# Altium schematic sheet ST-LINK.SchDoc
size A4
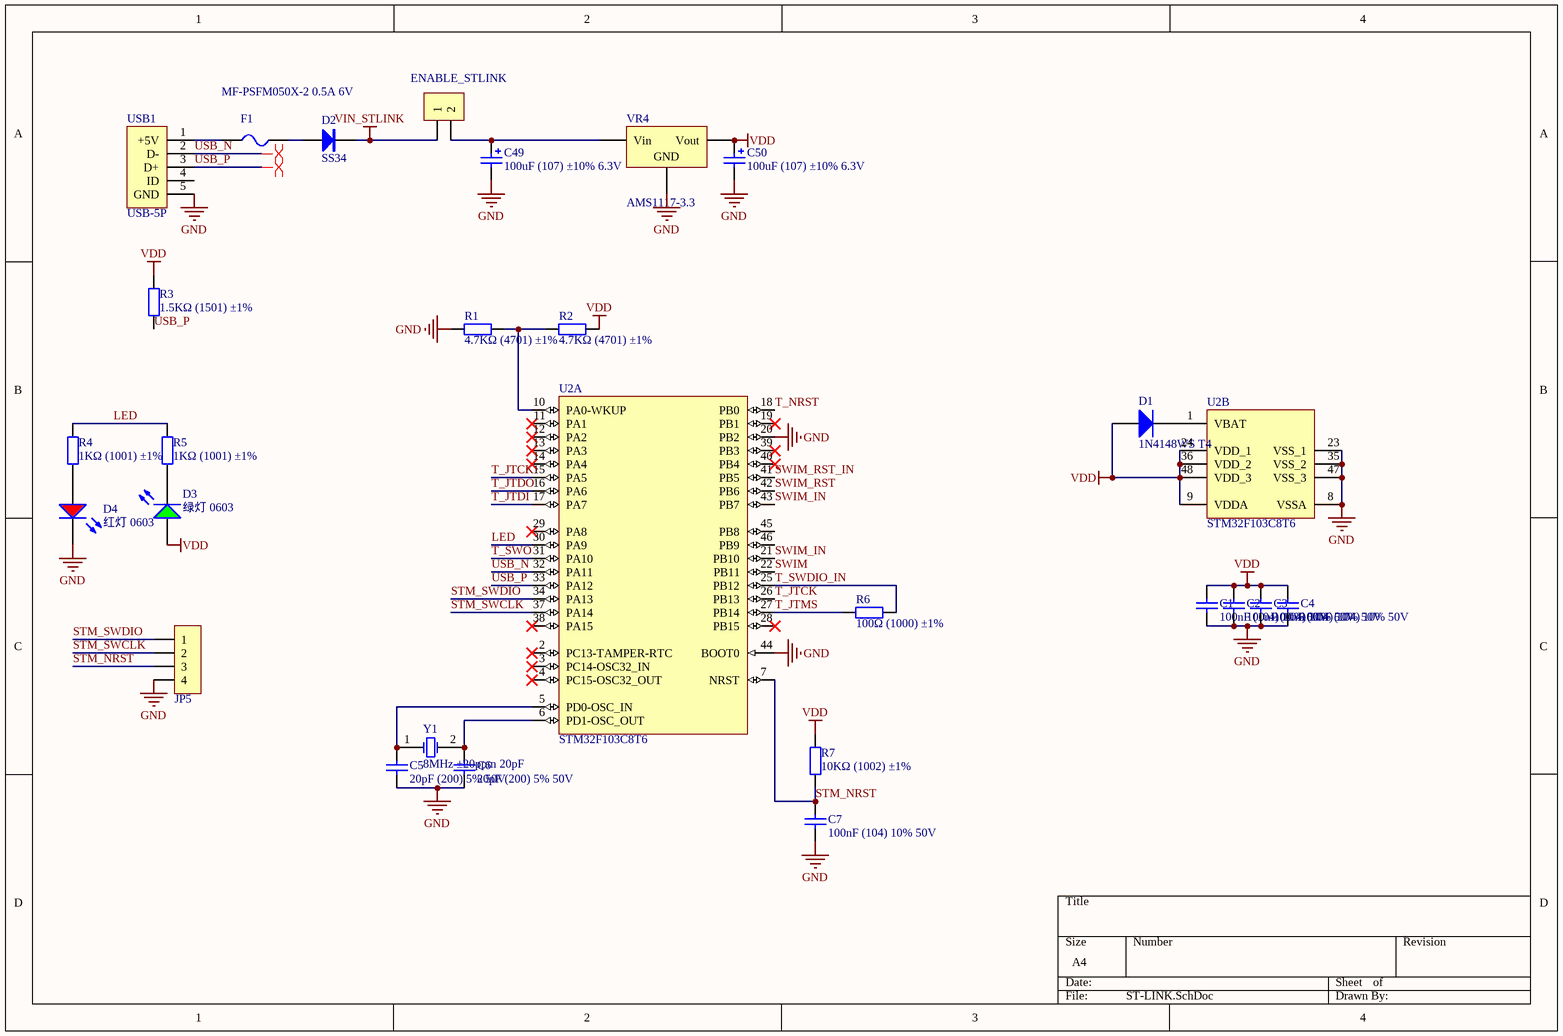
[diagram p0: ST-LINK.SchDoc]

## Parts
C1  100nF (104) 10% 50V  [0603_C]
C2  100nF (104) 10% 50V  [0603_C]
C3  100nF (104) 10% 50V  [0603_C]
C4  100nF (104) 10% 50V  [0603_C]
C5  20pF (200) 5% 50V  [0603_C]
C6  20pF (200) 5% 50V  [0603_C]
C7  100nF (104) 10% 50V  [0603_C]
C49  100uF (107) ±10% 6.3V  [CASE-B_3528]
C50  100uF (107) ±10% 6.3V  [CASE-B_3528]
D1  1N4148WS T4  [SOD-323]
D2  SS34  [SMC]
D3  绿灯 0603  [0603_LED_S1]
D4  红灯 0603  [0603_LED_S1]
ENABLE_STLINK  HDR-1X2  [HDR2.54-LI-2P]  (value not drawn)
F1  MF-PSFM050X-2 0.5A 6V  [FU 0805]
JP5  HDR-1X4  [HDR2.54-LI-4P]  (value not drawn)
R1  4.7KΩ (4701) ±1%  [0603_R]
R2  4.7KΩ (4701) ±1%  [0603_R]
R3  1.5KΩ (1501) ±1%  [0603_R]
R4  1KΩ (1001) ±1%  [0603_R]
R5  1KΩ (1001) ±1%  [0603_R]
R6  100Ω (1000) ±1%  [0603_R]
R7  10KΩ (1002) ±1%  [0603_R]
U2  STM32F103C8T6  [STM-LQFP48_L]  (parts A,B of 2)
USB1  USB-5P  [USB-MICRO_D]
VR4  AMS1117-3.3  [SOT-223]
Y1  8MHz ±20ppm 20pF  [SMD-5032_2P]

## Nets
GND: C1.1 C2.1 C3.1 C4.1 C5.1 C6.1 C7.1 C49.2 C50.2 D4.K JP5.4 R1.1 U2.8(VSSA) U2.20(PB2) U2.23(VSS_1) U2.35(VSS_2) U2.44(BOOT0) U2.47(VSS_3) USB1.5(GND) VR4.1(GND)
VDD: C1.2 C2.2 C3.2 C4.2 C50.1 D1.1(A) D3.A R2.2 R3.2 R7.2 U2.9(VDDA) U2.24(VDD_1) U2.36(VDD_2) U2.48(VDD_3) VR4.2(Vout)
VIN_STLINK: D2.2(K) ENABLE_STLINK.1
LED: R4.2 R5.2 U2.30(PA9)
STM_NRST: C7.2 JP5.3 R7.1 U2.7(NRST)
STM_SWCLK: JP5.2 U2.37(PA14)
STM_SWDIO: JP5.1 U2.34(PA13)
SWIM: U2.22(PB11)
SWIM_IN: U2.21(PB10) U2.43(PB7)
SWIM_RST: U2.42(PB6)
SWIM_RST_IN: U2.41(PB5)
T_JTCK: U2.15(PA5) U2.26(PB13)
T_JTDI: U2.17(PA7)
T_JTDO: U2.16(PA6)
T_JTMS: R6.1 U2.27(PB14)
T_NRST: U2.18(PB0)
T_SWDIO_IN: R6.2 U2.25(PB12)
T_SWO: U2.31(PA10)
USB_N: U2.32(PA11) USB1.2(D-)
USB_P: R3.1 U2.33(PA12) USB1.3(D+)
NetC5_2: C5.2 U2.5(PD0-OSC_IN) Y1.1(OSC1)
NetC6_2: C6.2 U2.6(PD1-OSC_OUT) Y1.2(OSC2)
NetC49_1: C49.1 ENABLE_STLINK.2 VR4.3(Vin)
NetD1_2: D1.2(K) U2.1(VBAT)
NetD2_1: D2.1(A) F1.2
NetD3_K: D3.K R5.1
NetD4_A: D4.A R4.1
NetF1_1: F1.1 USB1.1(+5V)
NetR1_2: R1.2 R2.1 U2.10(PA0-WKUP)

Not connected (* = marked no-connect by the designer): U2 2(PC13-TAMPER-RTC)* 3(PC14-OSC32_IN)* 4(PC15-OSC32_OUT)* 11(PA1)* 12(PA2)* 13(PA3)* 14(PA4)* 19(PB1)* 28(PB15)* 29(PA8)* 38(PA15)* 39(PB3)* 40(PB4)* 45(PB8) 46(PB9); USB1 4(ID)

## Layout directives
differential pair: USB_N, USB_P

## Library data of the parts
C1-C4 C7 = 0603 100nF (104) 10% 50V: 贴片电容; ComponentLink1Description: 供应商链接; ComponentLink1URL: http://www.szlcsc.com/product/details_15331.html; Package: 0603; Supplier: LC; SuppliersPartNumber: C14663
C5 C6 = 0603 20pF (200) 5% 50V: 贴片电容; ComponentLink1Description: 供应商链接; ComponentLink1URL: http://www.szlcsc.com/product/details_2000.html; Package: 0603; Supplier: LC; SuppliersPartNumber: C1648
C49 C50 = 3528 100uF (107) 10% 6.3V: 钽电容; ComponentLink1Description: 供应商链接; ComponentLink1URL: http://www.szlcsc.com/product/details_16815.html; Package: 3528; Supplier: LC; SuppliersPartNumber: C16133
D1 = SOD-323 1N4148WS T4: 二极管; ComponentLink1Description: 供应商链接; ComponentLink1URL: http://www.szlcsc.com/product/details_2485.html; Package: SOD-323; Supplier: LC; SuppliersPartNumber: C2128
D2 = SS34: 肖特基二极管; 版权归属: 源创客; 属性: 40V/3A; BOM名称: 肖特基二极管; 学习资源: www.ooocke.com
D3 = 0603 绿灯: 发光二极管; ComponentLink1Description: 供应商链接; ComponentLink1URL: http://www.szlcsc.com/product/details_73152.html; Package: 0603; Supplier: LC; SuppliersPartNumber: C72043
D4 = 0603 红灯: 发光二极管; ComponentLink1Description: 供应商链接; ComponentLink1URL: http://www.szlcsc.com/product/details_2659.html; Package: 0603; Supplier: LC; SuppliersPartNumber: C2286
ENABLE_STLINK = Header 2: 2P接插件; 版权归属: 源创客; BOM名称: 2P接插件; 学习资源: www.ooocke.com
F1 = FU: 贴片保险丝; 版权归属: 源创客; BOM名称: 贴片保险丝; 学习资源: www.ooocke.com
JP5 = Header 4: 4P接插件; 版权归属: 源创客; BOM名称: 4P接插件; 学习资源: www.ooocke.com
R1 R2 = 0603 4.7KΩ (4701) 1%: 贴片电阻; ComponentLink1Description: 供应商链接; ComponentLink1URL: http://www.szlcsc.com/product/details_23889.html; Package: 0603; Supplier: LC; SuppliersPartNumber: C23162
R3 = 0603 1.5KΩ (1501) 1%: 贴片电阻; ComponentLink1Description: 供应商链接; ComponentLink1URL: http://www.szlcsc.com/product/details_23570.html; Package: 0603; Supplier: LC; SuppliersPartNumber: C22843
R4 R5 = 0603 1KΩ (1001) 1%: 贴片电阻; ComponentLink1Description: 供应商链接; ComponentLink1URL: http://www.szlcsc.com/product/details_21904.html; Package: 0603; Supplier: LC; SuppliersPartNumber: C21190
R6 = 0603 100Ω (1000) 1%: 贴片电阻; ComponentLink1Description: 供应商链接; ComponentLink1URL: http://www.szlcsc.com/product/details_23502.html; Package: 0603; Supplier: LC; SuppliersPartNumber: C22775
R7 = 0603 10KΩ (1002) 1%: 贴片电阻; ComponentLink1Description: 供应商链接; ComponentLink1URL: http://www.szlcsc.com/product/details_26547.html; Package: 0603; Supplier: LC; SuppliersPartNumber: C25804
U2 = CMP-0237-00215-3: ARM Cortex-M3 32-bit MCU, 64 KB Flash, 20 KB Internal RAM, 37 I/Os, 48-pin LQFP, -40 to 85 degC, Tray; Supply Voltage(Vcc) min (V): 2; Internal RAM Size (kB): 20; FLASH Size (Prog) (kB): 64; A/D Converter: 2x12-bit (10 Channel); I/Os (High Current): 37; Operating Frequency(F) (Processor speed) (MHz): 72; Core: ARM Cortex-M3; ComponentLink3Description: Package Specification; Mounting Technology: Surface Mount; PartNumber: STM32F103C8T6; PackageReference: LQFP48; Packing: Tray; ComponentLink3URL: http://www.st.com/st-web-ui/static/active/en/resource/technical/document/datasheet/DM00058181.pdf; DatasheetVersion: Rev. 16; ComponentLink1URL: http://www.st.com/web/en/home.html; PackageVersion: Rev. 6, 06/2013; ComponentLink2URL: http://www.st.com/st-web-ui/static/active/en/resource/technical/document/datasheet/CD00161566.pdf; ComponentLink1Description: Manufacturer URL; ComponentLink2Description: Datasheet; PackageDescription: 48-Pin Low Profile Quad Flat Package, 7 x 7 mm Body, 0.5 mm Pitch; PartId: 1
USB1 = USB-5P: 微型USB母座; 版权归属: 源创客; BOM名称: 微型USB母座; 学习资源: www.ooocke.com
VR4 = SOT-223 AMS1117-3.3: 低压差线性稳压(LDO); ComponentLink1Description: 供应商链接; ComponentLink1URL: http://www.szlcsc.com/product/details_6652.html; Package: SOT-223; Supplier: LC; SuppliersPartNumber: C6186
Y1 = SMD-5032_2P 8MHz 20ppm 20pF: 贴片晶振; ComponentLink1Description: 供应商链接; ComponentLink1URL: http://www.szlcsc.com/product/details_117214.html; Package: SMD-5032_2P; Supplier: LC; SuppliersPartNumber: C115962